# EAGLE design uC board (EAGLE 9.6.2)
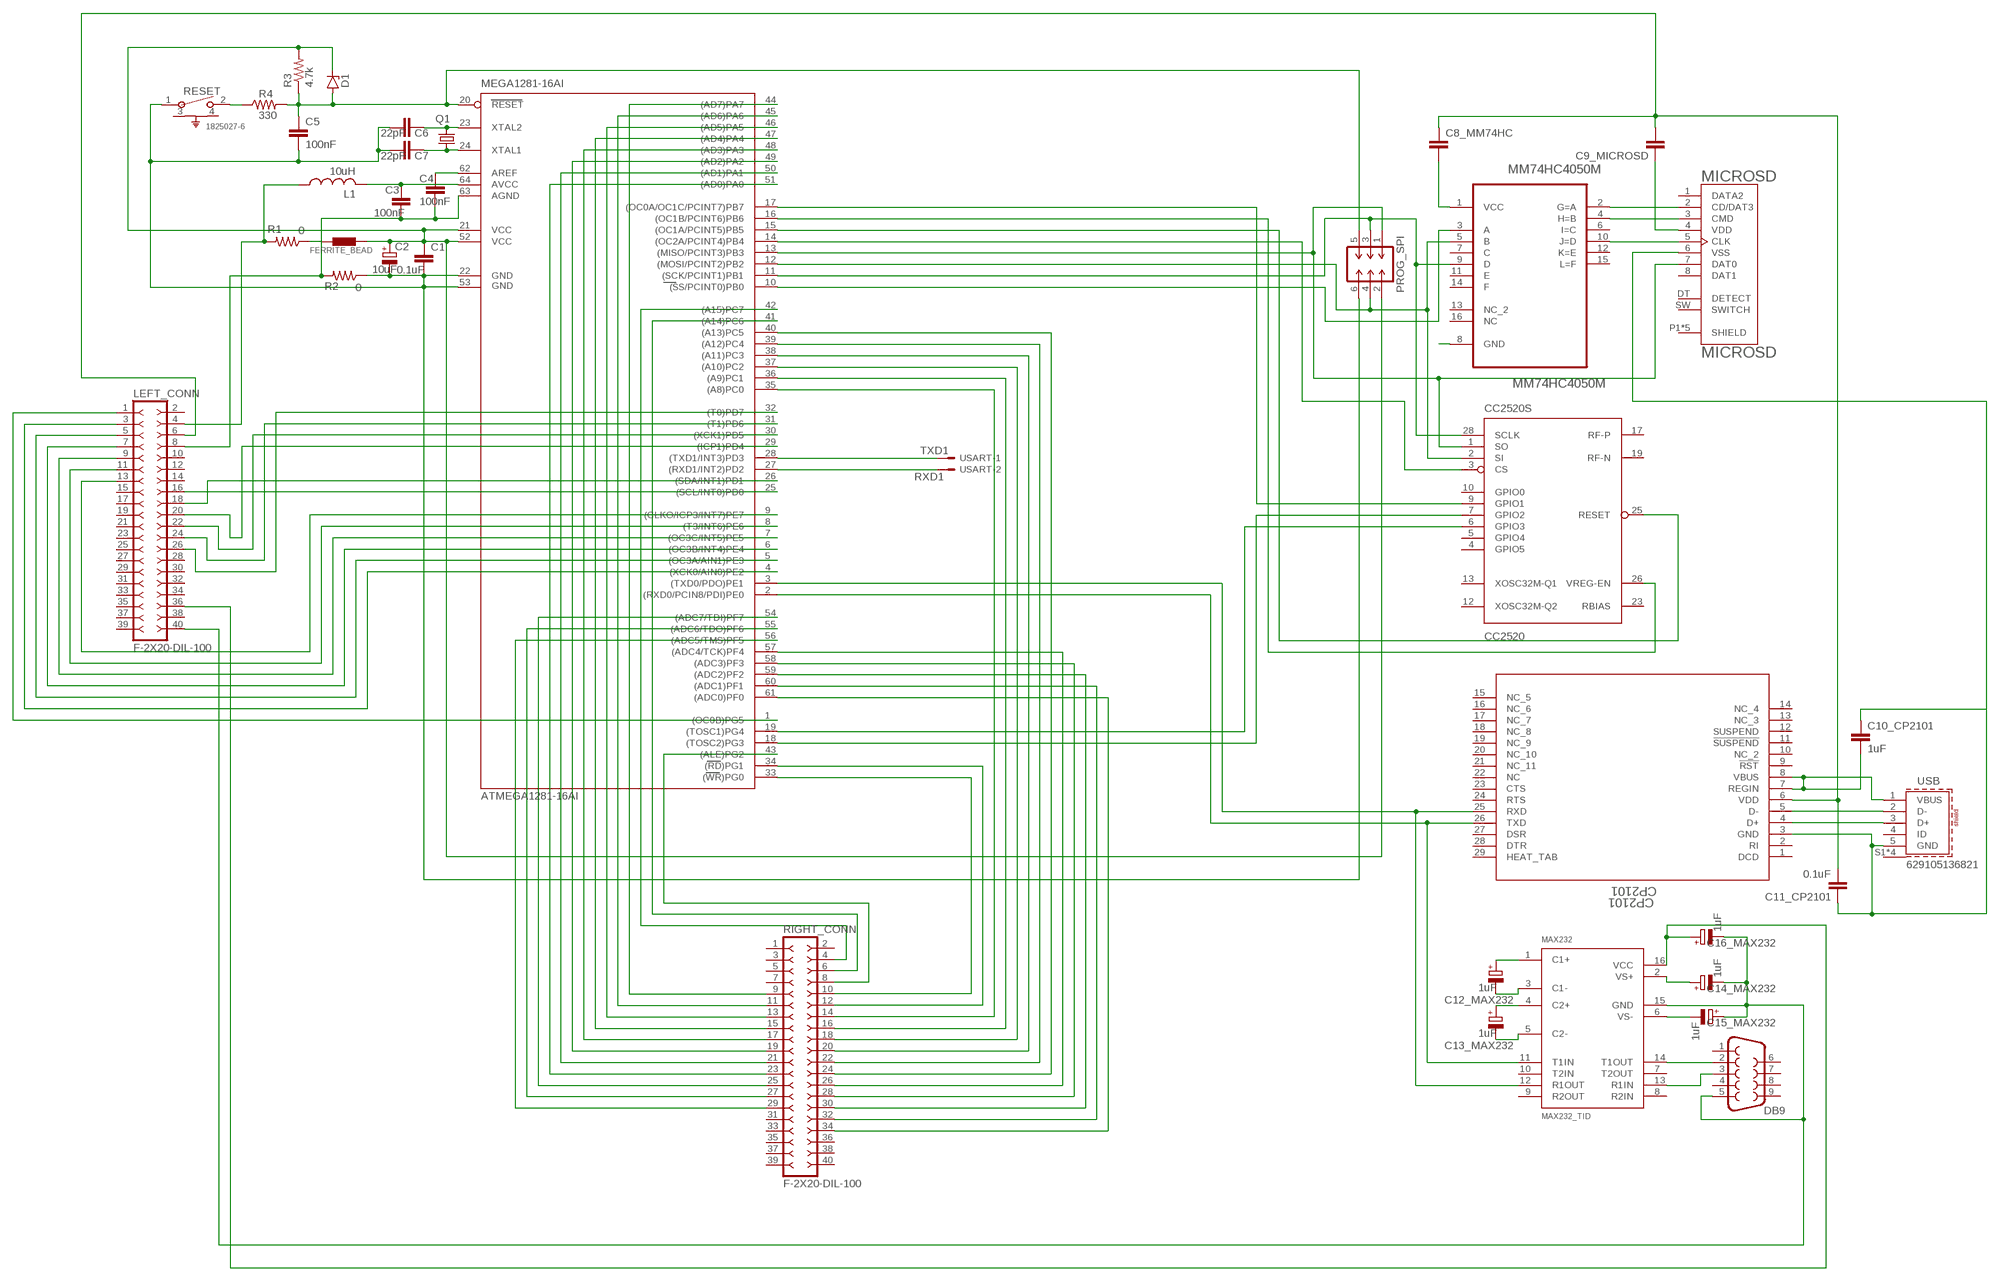
[diagram p0: schematic, sheet 1]

## Parts
C1  0.1uF  C-EUC0805K  [C0805K]
C2  10uF  CPOL-EUE5-10.5  [E5-10,5]
C3  100nF  C-EU025-024X044  [C025-024X044]
C4  100nF  C-EU025-024X044  [C025-024X044]
C5  100nF  C-EU025-024X044  [C025-024X044]
C6  22pF  C-EU025-024X044  [C025-024X044]
C7  22pF  C-EU025-024X044  [C025-024X044]
C8_MM74HC  C-EUC1210  [C1210]
C9_MICROSD  C-EUC1210  [C1210]
C10_CP2101  1uF  C-EUC1210  [C1210]
C11_CP2101  0.1uF  C-EUC1210  [C1210]
C12_MAX232  1uF  CPOL-EUE5-10.5  [E5-10,5]
C13_MAX232  1uF  CPOL-EUE5-10.5  [E5-10,5]
C14_MAX232  1uF  CPOL-EUE5-10.5  [E5-10,5]
C15_MAX232  1uF  CPOL-EUE5-10.5  [E5-10,5]
C16_MAX232  1uF  CPOL-EUE5-10.5  [E5-10,5]
CC2520  CC2520  [QFN50P500X500X100-29N]
CP2101  CP2101  [MLP28_SIL]
D1  ZENER-DIODEDO34-7  [DO34Z7]
DB9  DB9MALE  [DB9_MALE]
FERRITE_BEAD  BLM15HB121SN1  [0402]
L1  10uH  L-US0204/7  [0204/7]
LEFT_CONN  F-2X20-DIL-100  [DIL-100-2X20]
MAX232  MAX232_TID  [R-PDSO-G16]
MEGA1281-16AI  ATMEGA1281-16AI  [TQFP64]
MICROSD  MICROSD  [MOLEX_503182-1852]
MM74HC4050M  MM74HC4050M  [SOIC127P600X175-16N]
PROG_SPI  M-2X03-DIL-2MM_M  [DIL-2MM-2X03_M]
Q1  CRYSTALHC49S  [HC49/S]
R1  0  R-US_0204/5  [0204/5]
R2  0  R-US_0204/5  [0204/5]
R3  4.7k  R-US_0204/5  [0204/5]
R4  330  R-US_0204/5  [0204/5]
RESET  1825027-6  [SW2_1825027-B]
RIGHT_CONN  F-2X20-DIL-100  [DIL-100-2X20]
USART  332-02  [332-02]
USB  629105136821  [629105136821]

## Nets
N$1: C1.1 C2.+ D1.C FERRITE_BEAD.1 MEGA1281-16AI.21(VCC) MEGA1281-16AI.52(VCC1) PROG_SPI.2 R3.2
N$2: CC2520.1(S:SO) MEGA1281-16AI.13((MISO/PCINT3)PB3) MICROSD.7(DAT0) PROG_SPI.1
N$3: C3.1 L1.2 MEGA1281-16AI.64(AVCC)
N$4: C4.1 MEGA1281-16AI.62(AREF)
N$5: C3.2 C4.2 LEFT_CONN.8 MEGA1281-16AI.63(AGND) R2.2
N$6: FERRITE_BEAD.2 R1.1
N$7: L1.1 LEFT_CONN.4 R1.2
N$8: C5.1 D1.A MEGA1281-16AI.20(RESET) PROG_SPI.5 R3.1 R4.2
N$9: R4.1 RESET.2
N$10: C6.2 MEGA1281-16AI.23(XTAL2) Q1.2
N$11: C7.2 MEGA1281-16AI.24(XTAL1) Q1.1
N$12: CP2101.26(TXD) MAX232.11(T1IN) MEGA1281-16AI.2((RXD0/PCIN8/PDI)PE0)
N$13: CC2520.28(S:SCLK) MEGA1281-16AI.11((SCK/PCINT1)PB1) MM74HC4050M.9(D) PROG_SPI.3
N$14: CC2520.2(S:SI) MEGA1281-16AI.12((MOSI/PCINT2)PB2) MM74HC4050M.5(B) PROG_SPI.4
N$15: MICROSD.5(CLK) MM74HC4050M.10(J=D)
N$16: MEGA1281-16AI.10((SS/PCINT0)PB0) MM74HC4050M.3(A)
N$17: MICROSD.3(CMD) MM74HC4050M.4(H=B)
N$18: MICROSD.2(CD/DAT3) MM74HC4050M.2(G=A)
N$19: C9_MICROSD.1 MICROSD.4(VDD)
N$20: C10_CP2101.1 C11_CP2101.1 CP2101.3(GND) MICROSD.6(VSS) USB.5(GND)
N$21: C1.2 C2.- C5.2 C6.1 C7.1 MEGA1281-16AI.22(GND) MEGA1281-16AI.53(GND1) PROG_SPI.6 R2.1 RESET.1
N$22: C8_MM74HC.2 MM74HC4050M.1(VCC)
N$23: CC2520.3(S:CS) MEGA1281-16AI.14((OC2A/PCINT4)PB4)
N$24: CC2520.25(S:RESET) MEGA1281-16AI.15((OC1A/PCINT5)PB5)
N$25: CC2520.26(S:VREG-EN) MEGA1281-16AI.16((OC1B/PCINT6)PB6)
N$26: CC2520.9(S:GPIO1) MEGA1281-16AI.17((OC0A/OC1C/PCINT7)PB7)
N$27: CC2520.7(S:GPIO2) MEGA1281-16AI.18((TOSC2)PG3)
N$28: CC2520.6(S:GPIO3) MEGA1281-16AI.19((TOSC1)PG4)
N$29: MM74HC4050M.8(GND)
N$30: MEGA1281-16AI.28((TXD1/INT3)PD3) USART.1
N$31: C14_MAX232.- C15_MAX232.+ C16_MAX232.- DB9.5 LEFT_CONN.40 MAX232.15(GND)
N$32: C10_CP2101.2 CP2101.7(REGIN) CP2101.8(VBUS) USB.1(VBUS)
N$33: CP2101.5(D-) USB.2(D-)
N$34: CP2101.4(D+) USB.3(D+)
N$35: MEGA1281-16AI.27((RXD1/INT2)PD2) USART.2
N$37: C8_MM74HC.1 C9_MICROSD.2 C11_CP2101.2 CP2101.6(VDD) LEFT_CONN.6
N$39: CP2101.25(RXD) MAX232.12(R1OUT) MEGA1281-16AI.3((TXD0/PDO)PE1)
N$40: C13_MAX232.+ MAX232.4(C2+)
N$41: C12_MAX232.+ MAX232.1(C1+)
N$42: C12_MAX232.- MAX232.3(C1-)
N$43: C13_MAX232.- MAX232.5(C2-)
N$44: C14_MAX232.+ MAX232.2(VS+)
N$45: C15_MAX232.- MAX232.6(VS-)
N$47: C16_MAX232.+ LEFT_CONN.36 MAX232.16(VCC)
N$48: DB9.2 MAX232.14(T1OUT)
N$49: DB9.3 MAX232.13(R1IN)
N$50: LEFT_CONN.1 MEGA1281-16AI.1((OC0B)PG5)
N$51: LEFT_CONN.3 MEGA1281-16AI.4((XCK0/AIN0)PE2)
N$52: LEFT_CONN.5 MEGA1281-16AI.5((OC3A/AIN1)PE3)
N$53: LEFT_CONN.7 MEGA1281-16AI.6((OC3B/INT4)PE4)
N$54: LEFT_CONN.9 MEGA1281-16AI.7((OC3C/INT5)PE5)
N$55: LEFT_CONN.11 MEGA1281-16AI.8((T3/INT6)PE6)
N$56: LEFT_CONN.13 MEGA1281-16AI.9((CLKO/ICP3/INT7)PE7)
N$57: LEFT_CONN.16 MEGA1281-16AI.25((SCL/INT0)PD0)
N$58: LEFT_CONN.18 MEGA1281-16AI.26((SDA/INT1)PD1)
N$61: LEFT_CONN.20 MEGA1281-16AI.29((ICP1)PD4)
N$62: LEFT_CONN.22 MEGA1281-16AI.30((XCK1)PD5)
N$63: LEFT_CONN.24 MEGA1281-16AI.31((T1)PD6)
N$64: LEFT_CONN.26 MEGA1281-16AI.32((T0)PD7)
N$65: MEGA1281-16AI.41((A14)PC6) RIGHT_CONN.6
N$66: MEGA1281-16AI.42((A15)PC7) RIGHT_CONN.4
N$67: MEGA1281-16AI.43((ALE)PG2) RIGHT_CONN.8
N$68: MEGA1281-16AI.44((AD7)PA7) RIGHT_CONN.9
N$69: MEGA1281-16AI.45((AD6)PA6) RIGHT_CONN.11
N$70: MEGA1281-16AI.46((AD5)PA5) RIGHT_CONN.13
N$71: MEGA1281-16AI.47((AD4)PA4) RIGHT_CONN.15
N$72: MEGA1281-16AI.48((AD3)PA3) RIGHT_CONN.17
N$73: MEGA1281-16AI.49((AD2)PA2) RIGHT_CONN.19
N$74: MEGA1281-16AI.50((AD1)PA1) RIGHT_CONN.21
N$75: MEGA1281-16AI.51((AD0)PA0) RIGHT_CONN.23
N$76: MEGA1281-16AI.54((ADC7/TDI)PF7) RIGHT_CONN.25
N$77: MEGA1281-16AI.55((ADC6/TDO)PF6) RIGHT_CONN.27
N$78: MEGA1281-16AI.56((ADC5/TMS)PF5) RIGHT_CONN.29
N$79: MEGA1281-16AI.33((WR)PG0) RIGHT_CONN.10
N$80: MEGA1281-16AI.34((RD)PG1) RIGHT_CONN.12
N$81: MEGA1281-16AI.35((A8)PC0) RIGHT_CONN.14
N$82: MEGA1281-16AI.36((A9)PC1) RIGHT_CONN.16
N$83: MEGA1281-16AI.37((A10)PC2) RIGHT_CONN.18
N$84: MEGA1281-16AI.38((A11)PC3) RIGHT_CONN.20
N$85: MEGA1281-16AI.39((A12)PC4) RIGHT_CONN.22
N$86: MEGA1281-16AI.40((A13)PC5) RIGHT_CONN.24
N$87: MEGA1281-16AI.57((ADC4/TCK)PF4) RIGHT_CONN.26
N$88: MEGA1281-16AI.58((ADC3)PF3) RIGHT_CONN.28
N$89: MEGA1281-16AI.59((ADC2)PF2) RIGHT_CONN.30
N$90: MEGA1281-16AI.60((ADC1)PF1) RIGHT_CONN.32
N$91: MEGA1281-16AI.61((ADC0)PF0) RIGHT_CONN.34
Unconnected: CC2520.4(S:GPIO5) CC2520.5(S:GPIO4) CC2520.10(S:GPIO0) CC2520.12(S:XOSC32M-Q2) CC2520.13(S:XOSC32M-Q1) CC2520.15(NC) CC2520.17(S:RF-P) CC2520.18(NC) CC2520.19(S:RF-N) CC2520.21(NC) CC2520.23(S:RBIAS) CP2101.1(DCD) CP2101.2(RI) CP2101.9(!RST) CP2101.10(NC_2) CP2101.11(!SUSPEND) CP2101.12(SUSPEND) CP2101.13(NC_3) CP2101.14(NC_4) CP2101.15(NC_5) CP2101.16(NC_6) CP2101.17(NC_7) CP2101.18(NC_8) CP2101.19(NC_9) CP2101.20(NC_10) CP2101.21(NC_11) CP2101.22(NC) CP2101.23(CTS) CP2101.24(RTS) CP2101.27(DSR) CP2101.28(DTR) CP2101.29(HEAT_TAB) DB9.1 DB9.4 DB9.6 DB9.7 DB9.8 DB9.9 LEFT_CONN.2 LEFT_CONN.10 LEFT_CONN.12 LEFT_CONN.14 LEFT_CONN.15 LEFT_CONN.17 LEFT_CONN.19 LEFT_CONN.21 LEFT_CONN.23 LEFT_CONN.25 LEFT_CONN.27 LEFT_CONN.28 LEFT_CONN.29 LEFT_CONN.30 LEFT_CONN.31 LEFT_CONN.32 LEFT_CONN.33 LEFT_CONN.34 LEFT_CONN.35 LEFT_CONN.37 LEFT_CONN.38 LEFT_CONN.39 MAX232.7(T2OUT) MAX232.8(R2IN) MAX232.9(R2OUT) MAX232.10(T2IN) MICROSD.1(DATA2) MICROSD.8(DAT1) MICROSD.DT(DETECT) MICROSD.P1(SHIELD) MICROSD.P2(SHIELD) MICROSD.P3(SHIELD) MICROSD.P4(SHIELD) MICROSD.P5(SHIELD) MICROSD.SW(SWITCH) MM74HC4050M.6(I=C) MM74HC4050M.7(C) MM74HC4050M.11(E) MM74HC4050M.12(K=E) MM74HC4050M.13(NC_2) MM74HC4050M.14(F) MM74HC4050M.15(L=F) MM74HC4050M.16(NC) RESET.3 RESET.4 RIGHT_CONN.1 RIGHT_CONN.2 RIGHT_CONN.3 RIGHT_CONN.5 RIGHT_CONN.7 RIGHT_CONN.31 RIGHT_CONN.33 RIGHT_CONN.35 RIGHT_CONN.36 RIGHT_CONN.37 RIGHT_CONN.38 RIGHT_CONN.39 RIGHT_CONN.40 USB.4(ID) USB.S1(SHIELD) USB.S2(SHIELD) USB.S3(SHIELD) USB.S4(SHIELD)

## Notes on the sheet
- TXD1
- RXD1

## Power pins joined to a net without a drawn wire
AGND: CC2520.29(P:AGND)
AVDD: CC2520.11(P:AVDD) CC2520.14(P:AVDD) CC2520.16(P:AVDD) CC2520.20(P:AVDD) CC2520.22(P:AVDD)
AVDD-GUARD: CC2520.24(P:AVDD-GUARD)
DCOUPL: CC2520.27(P:DCOUPL)
DVDD: CC2520.8(P:DVDD)

## Library data of the parts
C1 C3-C7 C8_MM74HC C9_MICROSD C10_CP2101 C11_CP2101 = rcl:C-EU: CAPACITOR, European symbol; SPICEPREFIX: C
C2 C12_MAX232 C13_MAX232 C14_MAX232 C15_MAX232 C16_MAX232 = rcl:CPOL-EU: POLARIZED CAPACITOR, European symbol; SPICEPREFIX: C
CC2520 = ti CCxxxx series-v2:CC2520: 2.4 GHZ IEEE 802.15.4/ZIGBEE® RF TRANSCEIVER
CP2101 = CP2101:CP2101; BUILT_BY: EMA_UL_Team; MANUFACTURER_PART_NUMBER: CP2101; SOURCELIBRARY: Silicon_2010-04-20; VENDOR: Silicon Labs
D1 = diode:ZENER-DIODE: Z-Diode
DB9 = SparkFun-Connectors:DB9: DB9 Connector Standard DB9 (D-Sub 9) serial connector. Can be used for CAN bus as well as RS485 and RS232. Footprint production proven. Here is the female version connector we sell at SparkFun: 9 Pin Female Serial Connector - PCB Mount <https://www.sparkfun.com/products/429> (PRT-00429) This connector has been used on the following SparkFun products: SparkFun RS232 Shifter - SMD <https://www.sparkfun.com/products/449> (PRT-00449) SparkFun RS232 Shifter SMD (No DB9) <https://www.sparkfun.com/products/8780> (PRT-08780); PROD_ID: CONN-09904
FERRITE_BEAD = inductors:BLM15H: EMIFIL (R) Chip Ferrite Bead for GHz Noise Source: http://www.murata.com/ Ferrite Bead BLM15H.pdf
L1 = rcl:L-US: INDUCTOR, American symbol; SPICEPREFIX: L
LEFT_CONN RIGHT_CONN = con-headers-jp:F-2X20-: FEMALE HEADER
MAX232 = max232 ti_n:MAX232_TI: MAX232, Texas Instruments Version
MEGA1281-16AI = atmel-2005:ATMEGA1281*: MICROCONTROLLER 128 Kbytes FLASH 4 Kbytes EEPROM 8 Kbytes SRAM 54 General Purpose I/O pins 6-channels 16-bit PWM 2 x Serial USARTs 8-channels 10-bit A/D
MICROSD = SD card slots:MICROSD: Conn Micro SD Card M 8 POS 1.09mm Solder RA SMD Embossed T/R 0.5A/Contact Check prices <https://pricing.snapeda.com/search/part/5031821852/?ref=eda>; AVAILABILITY: Good; DESCRIPTION: 10 (8 + 2) Position Card Connector microSD™ Surface Mount, Right Angle Gold; MF: Molex; MP: 5031821852; PACKAGE: None; PRICE: None; PURCHASE-URL: https://pricing.snapeda.com/search/part/5031821852/?ref=eda
MM74HC4050M = MM74HC4050M:MM74HC4050M: Hex Inverting Logic Level Down Converter Check prices <https://pricing.snapeda.com/search/part/MM74HC4050M/?ref=eda> mm74hc4050m, logic level shifter; AVAILABILITY: Warning; DESCRIPTION: Buffer, Non-Inverting 6 Element 1 Bit per Element Push-Pull Output 16-TSSOP; MF: ON Semiconductor; MP: MM74HC4050M; PACKAGE: SOIC-16 Fairchild Semiconductor; PRICE: None; PURCHASE-URL: https://pricing.snapeda.com/search/part/MM74HC4050M/?ref=eda
PROG_SPI = con-headers-jp:M-2X03-: MALE HEADER
Q1 = crystal:CRYSTAL: CRYSTAL; OC_FARNELL: 1667008; OC_NEWARK: unknown
R1-R4 = rcl:R-US_: RESISTOR, American symbol; SPICEPREFIX: R
RESET = Switches:1825027-6; BUILT_BY: EMA_UL_Team; CATEGORY: Tactile Switches; CONFIGURATION__POLE-THROW_: Single Pole - Single Throw; COPYRIGHT: Copyright (C) 2016 Accelerated Designs. All rights reserved; DESCRIPTION: FSMRA2JHA04=R/A,TACT PB SW,260; MANUFACTURER_PART_NUMBER: 1825027-6; MAX_SWITCHING_CURRENT: -; MAX_SWITCHING_VOLTAGE_AC_: -; PART_STATUS: active; PRODUCT_TYPE: Switch; SERIES: Unknown; SWITCH_TYPE: Tactile Switches; TE_PART_NUMBER: 1825027-6; VENDOR: TE Connectivity
USART = con-garry:332-02: 2 Pin - 2mm Dual Row Source: www.mpe-connector.de / garry_shortform_2012.pdf
USB = Wurth_Connectors_WR-USB:629105136821: WR-COM Micro USB 2.0 SMT Type B Horizontal 5 Contacts Kind Properties Durability:10 000 Mating cycles Quality Class:10 000 Mating cycles Connector Type:Micro USB Gender:Receptacle Type:Horizontal General Information Operating Temperature:-40up to +105 °C Compliance:RoHS Electrical Properties IR 1:1A Working Voltage:30V (AC) Withstanding Voltage:100V (AC) Contact Resistance:30 mΩ Material Properties Insulator Material:LCP Insulator Flammability Rating:UL94 V-0 Color:Black Contact Material:Copper Alloy Contact Plating: Gold Contact Type:Stamped Shielding Material:Stainless Steel Shielding Plating:Nickel <https://www.we-online.com/catalog/media/o32999v209%20Family_WR-COM_629105136821.jpg> Details see: https://www.we-online.com/catalog/en/COM_MICRO_SMT_TYPE_B_HORIZONTAL/ Updated by Yingchun, Shan 2020-01-16 2020 (C) Würth Elektronik; APPLICATION: Micro USB 2.0; DATASHEET-URL: https://www.we-online.com/catalog/datasheet/629105136821.pdf; GERDER: Receptacle; INTERFACE-TYPE: Type B; IR1: 1.0A; MOUNT: SMT; PACKAGING: Tape and Reel; PART-NUMBER: 629105136821; PINS: 5; TYPE: Horizontal; WORKING-VOLTAGE: 30V(AC)

## Board
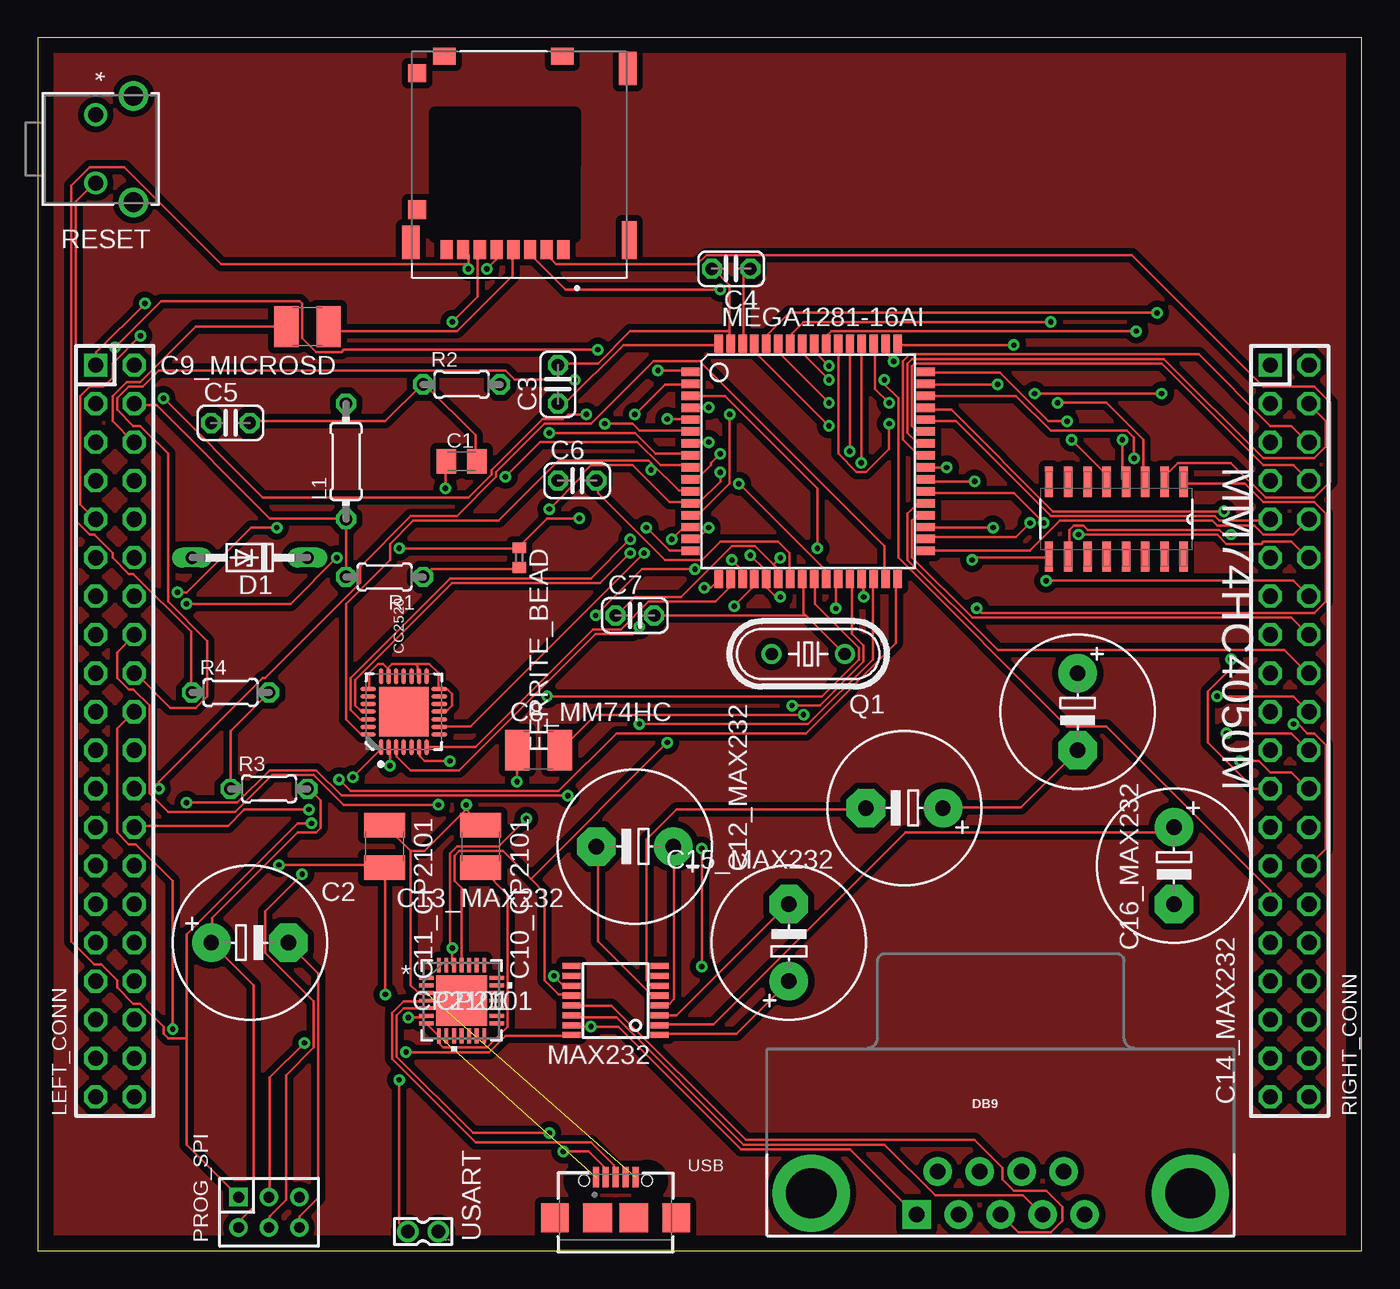
[diagram p1: board, top side]
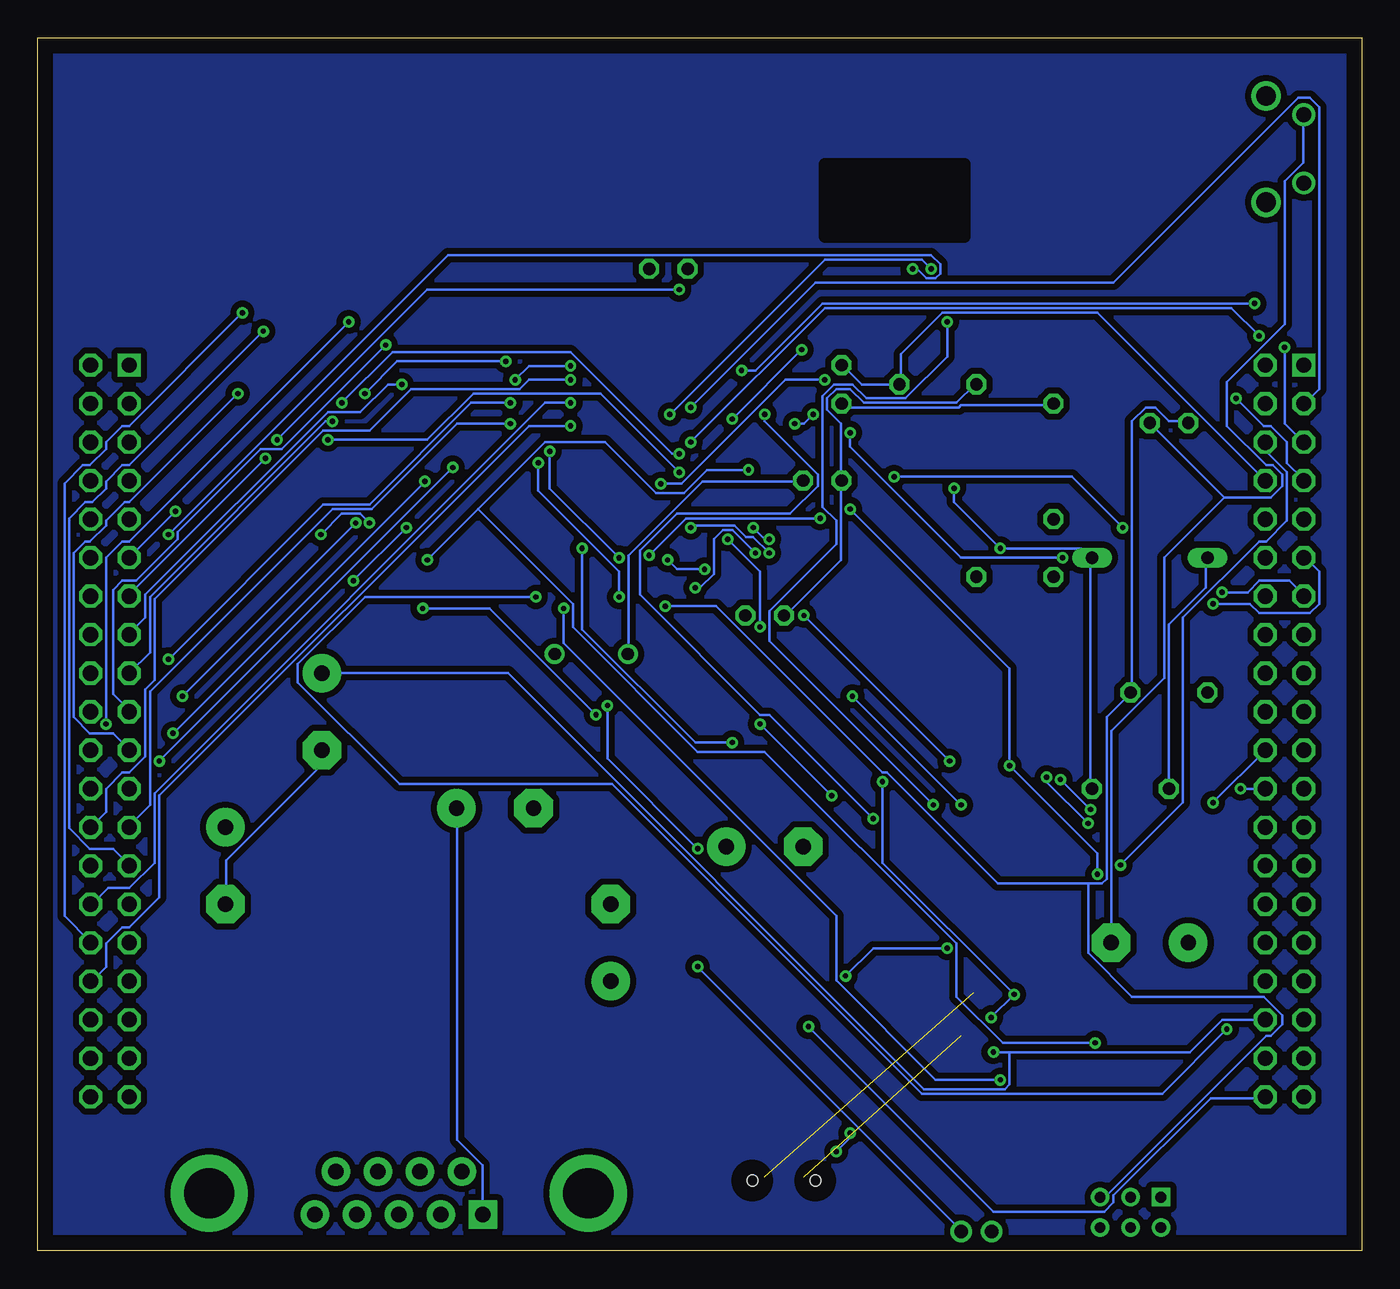
[diagram p2: board, bottom side, seen from below]

Size 87.3 x 80 mm. Coordinates in mm from the lower left corner, seen from the top.
Outline: 0,0 87.3,0 87.3,80 0,80 0,0
Copper layers (1*16): Top 0.035mm / dielectric 1.5mm / Bottom 0.035mm
Design rules "default": minimum track width 6mil, minimum drill 0.35mm, track to track 6mil, track to pad 6mil, pad to pad 6mil, via to via 6mil, smd to smd 6mil, copper to edge 40mil, drill to drill 6mil, minimum pad ring 10mil, minimum via ring 8mil, stop-mask expansion 4mil, vias tented up to drill 0mil, thermal gap 10mil

### Footprints (pad centres in the part's own frame; a part is rotated, then mirrored left to right if it is on the bottom)
C0805K = smd 1.3 x 1.6: 1 -1,0; 2 1,0
E5-10,5 = drill 1.016 pad 2.54: + -2.54,0 | drill 1.016 pad 2.54 octagon: - 2.54,0
C025-024X044 = drill 0.813 octagon: 1 -1.27,0; 2 1.27,0
C1210 = smd 1.6 x 2.7: 1 -1.4,0; 2 1.4,0
QFN50P500X500X100-29N = smd 1.05 x 0.3: 1 -2.35,1.5; 2 -2.35,1; 3 -2.35,0.5; 4 -2.35,0; 5 -2.35,-0.5; 6 -2.35,-1; 7 -2.35,-1.5; 15 2.35,-1.5; 16 2.35,-1; 17 2.35,-0.5; 18 2.35,0; 19 2.35,0.5; 20 2.35,1; 21 2.35,1.5 | smd 0.3 x 1.05: 8 -1.5,-2.35; 9 -1,-2.35; 10 -0.5,-2.35; 11 0,-2.35; 12 0.5,-2.35; 13 1,-2.35; 14 1.5,-2.35; 22 1.5,2.35; 23 1,2.35; 24 0.5,2.35; 25 0,2.35; 26 -0.5,2.35; 27 -1,2.35; 28 -1.5,2.35 | smd 3.25 x 3.25: 29 0,0
MLP28_SIL = smd 0.965 x 0.254: 1 -2.324,1.5; 2 -2.324,1; 3 -2.324,0.5; 4 -2.324,0; 5 -2.324,-0.5; 6 -2.324,-1; 7 -2.324,-1.5; 15 2.324,-1.5; 16 2.324,-1; 17 2.324,-0.5; 18 2.324,0; 19 2.324,0.5; 20 2.324,1; 21 2.324,1.5 | smd 0.254 x 0.965: 8 -1.5,-2.324; 9 -1,-2.324; 10 -0.5,-2.324; 11 0,-2.324; 12 0.5,-2.324; 13 1,-2.324; 14 1.5,-2.324; 22 1.5,2.324; 23 1,2.324; 24 0.5,2.324; 25 0,2.324; 26 -0.5,2.324; 27 -1,2.324; 28 -1.5,2.324 | smd 3.353 x 3.353: 29 0,0
DO34Z7 = drill 0.813 long: A 3.81,0; C -3.81,0
DB9_MALE = drill 1.016 pad 1.88: 1 5.54,-1.42; 2 2.77,-1.42; 3 0,-1.42; 4 -2.77,-1.42; 6 4.15,1.42; 7 1.38,1.42; 8 -1.38,1.42; 9 -4.15,1.42 | drill 1.016 pad 1.88 square: 5 -5.54,-1.42 | drill 3.302 pad 5.08: G1 -12.5,0; G2 12.5,0
0402 = smd 0.7 x 0.9: 1 -0.65,0; 2 0.65,0
0204/7 = drill 0.813 octagon: 1 -3.81,0; 2 3.81,0
DIL-100-2X20 = drill 1.016 square: 1 -24.13,-1.27 | drill 1.016 octagon: 2 -24.13,1.27; 3 -21.59,-1.27; 4 -21.59,1.27; 5 -19.05,-1.27; 6 -19.05,1.27; 7 -16.51,-1.27; 8 -16.51,1.27; 9 -13.97,-1.27; 10 -13.97,1.27; 11 -11.43,-1.27; 12 -11.43,1.27; 13 -8.89,-1.27; 14 -8.89,1.27; 15 -6.35,-1.27; 16 -6.35,1.27; 17 -3.81,-1.27; 18 -3.81,1.27; 19 -1.27,-1.27; 20 -1.27,1.27; 21 1.27,-1.27; 22 1.27,1.27; 23 3.81,-1.27; 24 3.81,1.27; 25 6.35,-1.27; 26 6.35,1.27; 27 8.89,-1.27; 28 8.89,1.27; 29 11.43,-1.27; 30 11.43,1.27; 31 13.97,-1.27; 32 13.97,1.27; 33 16.51,-1.27; 34 16.51,1.27; 35 19.05,-1.27; 36 19.05,1.27; 37 21.59,-1.27; 38 21.59,1.27; 39 24.13,-1.27; 40 24.13,1.27
R-PDSO-G16 = smd 0.4 x 1.2: 1 -2.275,-2.9; 2 -1.625,-2.9; 3 -0.975,-2.9; 4 -0.325,-2.9; 5 0.325,-2.9; 6 0.975,-2.9; 7 1.625,-2.9; 8 2.275,-2.9; 9 2.275,2.9; 10 1.625,2.9; 11 0.975,2.9; 12 0.325,2.9; 13 -0.325,2.9; 14 -0.975,2.9; 15 -1.625,2.9; 16 -2.275,2.9
TQFP64 = smd 1.194 x 0.559: 1 -7.76,5.905; 2 -7.76,5.118; 3 -7.76,4.331; 4 -7.76,3.543; 5 -7.76,2.756; 6 -7.76,1.968; 7 -7.76,1.181; 8 -7.76,0.394; 9 -7.76,-0.394; 10 -7.76,-1.181; 11 -7.76,-1.968; 12 -7.76,-2.756; 13 -7.76,-3.543; 14 -7.76,-4.331; 15 -7.76,-5.118; 16 -7.76,-5.905; 33 7.76,-5.905; 34 7.76,-5.118; 35 7.76,-4.331; 36 7.76,-3.543; 37 7.76,-2.756; 38 7.76,-1.968; 39 7.76,-1.181; 40 7.76,-0.394; 41 7.76,0.394; 42 7.76,1.181; 43 7.76,1.968; 44 7.76,2.756; 45 7.76,3.543; 46 7.76,4.331; 47 7.76,5.118; 48 7.76,5.905 | smd 0.559 x 1.194: 17 -5.905,-7.76; 18 -5.118,-7.76; 19 -4.331,-7.76; 20 -3.543,-7.76; 21 -2.756,-7.76; 22 -1.968,-7.76; 23 -1.181,-7.76; 24 -0.394,-7.76; 25 0.394,-7.76; 26 1.181,-7.76; 27 1.968,-7.76; 28 2.756,-7.76; 29 3.543,-7.76; 30 4.331,-7.76; 31 5.118,-7.76; 32 5.905,-7.76; 49 5.905,7.76; 50 5.118,7.76; 51 4.331,7.76; 52 3.543,7.76; 53 2.756,7.76; 54 1.968,7.76; 55 1.181,7.76; 56 0.394,7.76; 57 -0.394,7.76; 58 -1.181,7.76; 59 -1.968,7.76; 60 -2.756,7.76; 61 -3.543,7.76; 62 -4.331,7.76; 63 -5.118,7.76; 64 -5.905,7.76
MOLEX_503182-1852 = smd 0.8 x 1.24: 1 -2.9,6.355; 2 -1.8,6.355; 3 -0.7,6.355; 4 0.4,6.355; 5 1.5,6.355; 6 2.6,6.355; 7 3.7,6.355; 8 4.8,6.355 | smd 1.16 x 1.2: DT 6.74,-5.275 | smd 0.95 x 2.5: P1 -7.245,5.725 | smd 1.15 x 2.2: P2 7.145,5.875; P3 -7.145,-5.605 | smd 1.5 x 1.15: P4 -2.84,-6.4; P5 4.94,-6.4 | smd 1.16 x 1.25: SW 6.74,3.725
SOIC127P600X175-16N = smd 1.981 x 0.559: 1 -2.464,4.445; 2 -2.464,3.175; 3 -2.464,1.905; 4 -2.464,0.635; 5 -2.464,-0.635; 6 -2.464,-1.905; 7 -2.464,-3.175; 8 -2.464,-4.445; 9 2.464,-4.445; 10 2.464,-3.175; 11 2.464,-1.905; 12 2.464,-0.635; 13 2.464,0.635; 14 2.464,1.905; 15 2.464,3.175; 16 2.464,4.445
DIL-2MM-2X03_M = drill 0.711 square: 1 -2,1 | drill 0.711: 2 -2,-1; 3 0,1; 4 0,-1; 5 2,1; 6 2,-1
HC49/S = drill 0.813: 1 -2.413,0; 2 2.413,0
0204/5 = drill 0.813 octagon: 1 -2.54,0; 2 2.54,0
SW2_1825027-B = drill 0.991 pad 1.499: 1 0,0; 2 4.496,0 | drill 1.295 pad 1.803: 3 -1.245,2.489; 4 5.766,2.489
332-02 = drill 0.9 pad 1.27: 1 0,-1; 2 0,1
629105136821 = smd 0.4 x 1.35: 1 -1.3,2.325; 2 -0.65,2.325; 3 0,2.325; 4 0.65,2.325; 5 1.3,2.325 | smd 1.8 x 1.9: S1 -4,-0.35; S4 4,-0.35 | smd 1.9 x 1.9: S2 -1.2,-0.35; S3 1.2,-0.35 | hole 0.7: -2.075,2.1; 2.075,2.1

### Placement (x,y rotation side)
C1  27.94,52.07 0 top
C2  13.97,20.32 0 top
C3  34.29,57.15 90 top
C4  45.72,64.77 180 top
C5  12.7,54.61 0 top
C6  35.56,50.8 0 top
C7  39.37,41.91 0 top
C8_MM74HC  33.02,33.02 0 top
C9_MICROSD  17.78,60.96 180 top
C10_CP2101  29.21,26.67 270 top
C11_CP2101  22.86,26.67 270 top
C12_MAX232  49.53,20.32 90 top
C13_MAX232  39.37,26.67 180 top
C14_MAX232  74.93,25.4 270 top
C15_MAX232  57.15,29.21 180 top
C16_MAX232  68.58,35.56 270 top
CC2520  24.13,35.56 90 top
CP2101  27.94,16.51 0 top
D1  13.97,45.72 180 top
DB9  63.5,3.81 0 top
FERRITE_BEAD  31.75,45.72 270 top
L1  20.32,52.07 90 top
LEFT_CONN  5.08,34.29 270 top
MAX232  38.1,16.51 90 top
MEGA1281-16AI  50.8,52.07 0 top
MICROSD  31.75,72.39 180 top
MM74HC4050M  71.12,48.26 270 top
PROG_SPI  15.24,2.54 0 top
Q1  50.8,39.37 180 top
R1  22.86,44.45 180 top
R2  27.94,57.15 0 top
R3  15.24,30.48 0 top
R4  12.7,36.83 0 top
RESET  3.81,74.93 270 top
RIGHT_CONN  82.55,34.29 270 top
USART  25.4,1.27 90 top
USB  38.1,2.54 0 top

### Tracks (layer width: path | path; a pad name or v marks a point on that pad's centre or on a via)
AVDD
  Top 0.152: CC2520.11 26.57,35.66 27.03,35.66 27.33,35.97 27.33,36.73 27.03,37.03 26.57,37.03 CC2520.14 26.42,37.19 26.42,38.1 25.81,38.71 24.89,38.71 | 23.06,38.41 22.76,38.71 22.45,38.71 21.84,38.1 21.84,37.19 CC2520.22 | 23.06,38.41 23.06,37.95 CC2520.20 23.06,38.41 | 24.89,38.71 25.04,38.56 25.04,37.95 CC2520.16 | 24.89,38.71 23.37,38.71 23.06,38.41
GND
  pour Top (isolate 0.406): 0,80.01 87.63,80.01 87.63,0 0,0
  pour Bottom (isolate 0.406): 0,80.01 87.63,80.01 87.63,0 0,0
N$1  (via drill 0.35)
  Top 0.152: PROG_SPI.2 13.31,1.68 13.31,1.98 14.22,2.9 14.22,17.53 C2.+ 11.48,20.42 11.48,21.95 17.12,27.58 18.34,27.58 18.64,27.89 18.64,29.72 17.88,30.48 R3.2 | v23.83,46.33 31.75,46.33 FERRITE_BEAD.1 31.75,46.48 33.58,48.31 v35.71,48.31 | v46.99,45.87 47.9,44.96 47.9,44.35 MEGA1281-16AI.21 48.06,44.2 48.06,43.74 48.67,43.13 v48.97,43.13 | v54.3,51.97 54.3,59.74 MEGA1281-16AI.52 | v26.87,50.29 26.87,51.97 C1.1
  Bottom 0.152: 17.88,45.72 18.49,46.33 v23.83,46.33 26.87,49.38 v26.87,50.29 | v46.99,45.87 44.55,48.31 v35.71,48.31 | v54.3,51.97 54.3,50.14 48.97,44.81 v48.97,43.13 | 17.88,45.72 17.88,30.48 R3.2 | 17.88,45.72 D1.C
N$2  (via drill 0.35)
  Top 0.152: v45.62,55.17 45.62,50.6 43.64,48.62 43.18,48.62 MEGA1281-16AI.13 | 28.4,65.08 28.4,65.68 28.09,65.99 MICROSD.7 | v20.78,31.24 22.61,33.07 CC2520.1 | v18.03,28.19 17.12,28.19 9.8,20.88 9.8,14.02 | 9.8,14.02 9.8,7.01 13.16,3.66 PROG_SPI.1 | 28.4,65.08 12.09,65.08 5.69,71.48 3.4,71.48 2.18,70.26 2.18,20.42 3.71,18.9 4.17,18.9 5.23,17.83 5.23,17.37 6.3,16.31 6.76,16.31 8.28,14.78 8.28,14.33 8.59,14.02 9.8,14.02 | 28.4,65.08 v28.4,64.77
  Bottom 0.152: v45.62,55.17 35.41,65.38 29.01,65.38 v28.4,64.77 | v20.78,31.24 20.78,30.94 v18.03,28.19
N$3
  Top 0.152: MEGA1281-16AI.64 44.86,59.74 38.61,59.74 34.8,55.93 34.34,55.93 C3.1
  Bottom 0.152: C3.1 34.04,55.63 26.57,55.63 26.42,55.78 20.32,55.78 L1.2
N$4
  Top 0.152: C4.1 46.53,64.31 46.53,59.89 MEGA1281-16AI.62
N$5
  Top 0.152: 45.62,60.66 45.62,63.7 44.55,64.77 C4.2 | 45.62,60.66 45.62,59.89 MEGA1281-16AI.63 | 45.62,60.66 39.06,60.66 36.93,58.52 34.34,58.52 C3.2
  Bottom 0.152: C3.2 34.19,58.37 32.97,57.15 R2.2 30.38,57.15 30.38,59.13 27.63,61.87 17.42,61.87 LEFT_CONN.8
N$6
  Top 0.152: FERRITE_BEAD.2 31.75,44.96 25.96,44.96 25.5,44.5 R1.1
N$7
  Top 0.152: R1.2 L1.1 20.32,48.31 15.29,48.31 7.82,55.78 6.45,55.78 LEFT_CONN.4
N$8  (via drill 0.35)
  Top 0.152: v45.92,42.52 47.14,43.74 47.14,44.2 MEGA1281-16AI.20 | R3.1 12.7,34.29 R4.2
  Bottom 0.152: R3.1 12.7,41.3 10.26,43.74 10.26,45.72 D1.A | v45.92,42.52 42.57,42.52 31.6,31.55 31.29,31.55 23.98,24.23 18.03,24.23 | 18.03,24.23 17.12,24.23 16.81,24.54 16.81,35.2 15.29,36.73 R4.2 15.14,36.88 15.14,54.71 14.22,55.63 13.61,55.63 12.7,54.71 11.48,54.71 C5.1 | 18.03,24.23 18.03,19.66 15.14,16.76 6.45,16.76 5.23,15.54 5.23,14.94 5.99,14.17 6.3,14.17 16.81,3.66 17.12,3.66 PROG_SPI.5
N$9
  Top 0.152: R4.1 10.11,36.88 10.11,40.84 6.3,44.65 5.99,44.65 4.93,45.72 4.93,46.02 3.71,47.24 3.4,47.24 2.49,48.16 2.49,69.19 3.71,70.41 RESET.2
N$10
  Top 0.152: MEGA1281-16AI.23 49.58,44.35 49.58,46.02 48.82,46.79 45.01,46.79 43.79,45.57 41.35,45.57 36.93,49.99 36.93,50.75 C6.2
  Bottom 0.152: Q1.2 48.36,39.47 48.36,45.87 43.48,50.75 36.93,50.75 C6.2
N$11
  Top 0.152: 50.65,41.91 53.09,39.47 Q1.1 | 50.65,41.91 50.49,42.06 50.49,44.2 MEGA1281-16AI.24 | 50.65,41.91 C7.2
N$12  (via drill 0.35)
  Top 0.152: v34.04,18.14 34.65,17.53 35.1,17.53 MAX232.11 | CP2101.26 27.33,18.9 v27.33,19.96 27.18,20.12 27.18,26.21 27.63,26.67 30.38,26.67 v32.21,28.5 | v39.37,55.17 41.35,57.15 43.03,57.15 MEGA1281-16AI.2
  Bottom 0.152: v27.33,19.96 32.21,19.96 v34.04,18.14 | v39.37,55.17 39.37,54.71 35.87,51.21 35.87,50.44 37.69,48.62 45.16,48.62 47.6,46.18 47.6,43.28 39.67,35.36 39.06,35.36 v32.21,28.5
N$13  (via drill 0.35)
  Top 0.152: 40.44,51.97 42.27,50.14 43.03,50.14 MEGA1281-16AI.11 | 40.44,51.97 40.28,52.12 34.34,52.12 30.38,48.16 24.74,48.16 23.22,46.63 23.22,45.57 20.32,42.67 20.32,35.05 21.23,34.14 21.69,34.14 CC2520.28 | v61.62,45.57 61.77,45.72 66.65,45.72 MM74HC4050M.9 | 40.44,51.97 v40.44,51.51 | v17.58,13.72 15.29,11.43 15.29,3.66 PROG_SPI.3
  Bottom 0.152: 58.27,48.92 53.85,53.34 49.89,53.34 46.53,49.99 44.7,49.99 43.18,51.51 v40.44,51.51 | 58.27,48.92 v61.62,45.57 | v17.58,13.72 23.67,13.72 26.72,16.76 26.72,20.27 39.37,32.92 43.79,32.92 52.02,41.15 52.02,42.67 58.27,48.92
N$14  (via drill 0.35)
  Top 0.152: v23.22,32 23.22,33.07 CC2520.2 | v33.73,48.92 35.87,51.05 35.87,51.21 36.47,51.82 39.22,51.82 41.66,49.38 43.03,49.38 MEGA1281-16AI.12 43.18,49.38 43.64,49.38 45.01,50.75 v45.01,51.36 | v68.17,53.49 70.46,51.21 70.46,50.75 MM74HC4050M.5 | v17.42,24.84 14.99,22.4 14.99,19.66 18.19,16.46 18.19,13.41 16.36,11.58 16.36,3.35 15.29,2.29 15.29,1.68 PROG_SPI.4
  Bottom 0.152: v33.73,48.92 23.22,38.41 v23.22,32 17.42,26.21 v17.42,24.84 | v68.17,53.49 61.62,53.49 58.57,56.54 50.19,56.54 v45.01,51.36
N$15  (via drill 0.35)
  Top 0.152: v29.62,64.77 30.23,65.38 30.23,65.99 MICROSD.5 | v78.69,47.24 78.23,47.24 77.93,47.55 69.24,47.55 68.94,47.85 68.33,47.85 68.02,47.55 68.02,45.87 MM74HC4050M.10
  Bottom 0.152: v29.62,64.77 29.31,64.77 28.7,64.16 28.09,64.16 27.79,64.47 27.79,65.08 28.4,65.68 60.25,65.68 v78.69,47.24
N$16  (via drill 0.35)
  Top 0.152: v45.01,52.58 44.4,51.97 44.4,51.82 43.48,50.9 43.18,50.9 MEGA1281-16AI.10 | v67.26,55.93 70.46,55.93 72.9,53.49 72.9,50.75 MM74HC4050M.3
  Bottom 0.152: v45.01,52.58 45.47,52.58 52.17,59.28 63.91,59.28 v67.26,55.93
N$17  (via drill 0.35)
  Top 0.152: v45.01,63.4 34.8,63.4 32.51,65.68 32.51,65.99 MICROSD.3 | v71.53,53.49 71.53,50.9 71.68,50.75 MM74HC4050M.4
  Bottom 0.152: v45.01,63.4 61.62,63.4 v71.53,53.49
N$18
  Top 0.152: MICROSD.2 33.58,65.99 33.58,65.68 34.19,65.08 43.48,65.08 44.09,65.68 72.14,65.68 80.82,57 84.18,57 85.24,55.93 85.24,50.75 84.18,49.68 80.98,49.68 78.69,51.97 75.18,51.97 74.42,51.21 74.42,50.75 MM74HC4050M.2
N$19
  Top 0.152: MICROSD.4 31.29,65.99 31.29,64.31 27.63,60.66 19.56,60.66 19.25,60.96 C9_MICROSD.1
N$20  (via drill 0.35)  (1 unrouted)
  Top 0.152: 24.59,26.36 24.59,17.53 25.04,17.07 25.5,17.07 CP2101.3 | 24.59,26.36 22.91,28.04 C11_CP2101.1 | v27.33,61.27 29.01,62.94 29.01,65.99 MICROSD.6 | 28.24,29.11 29.16,28.19 C10_CP2101.1 | 24.59,26.36 25.5,26.36 28.24,29.11 | 28.24,29.11 v28.24,29.41
  Bottom 0.152: v27.33,61.27 27.33,58.98 30.07,56.24 32.66,56.24 33.58,57.15 34.8,57.15 35.56,56.39 35.56,49.07 34.65,48.16 34.65,46.63 39.06,42.22 39.06,40.23 v28.24,29.41
N$21  (via drill 0.35)
  Top 0.152: 48.51,45.26 47.3,46.48 45.77,46.48 42.42,43.13 39.37,43.13 38.15,41.91 C7.1 | 48.51,45.26 48.82,44.96 48.82,44.35 MEGA1281-16AI.22 | v53.54,52.73 53.54,59.74 MEGA1281-16AI.53 | 48.51,45.26 v48.97,45.72 | PROG_SPI.6 17.27,1.68 17.27,2.29 18.49,3.5 18.49,18.29 16.51,20.27 C2.- | C1.2 28.85,52.12 28.85,53.8 25.5,57.15 R2.1 25.35,57.15 22.91,54.71 14.07,54.71 C5.2
  Bottom 0.152: v53.54,52.73 53.54,50.29 v48.97,45.72 | C7.1 38,41.91 34.34,45.57 34.34,50.75 C6.1 34.34,50.9 34.34,54.56 35.25,55.47 35.25,56.24 34.65,56.84 33.73,56.84 32.82,55.93 26.72,55.93 25.5,57.15 R2.1 | 9.04,49.68 5.99,49.68 5.23,50.44 5.23,51.21 5.84,51.82 6.3,51.82 8.89,54.41 8.89,57.3 5.08,61.11 5.08,70.56 3.86,71.78 3.86,74.83 RESET.1 | C5.2 9.04,49.68 | C2.- 16.51,34.29 13.01,37.8 13.01,45.72 9.04,49.68
N$22  (via drill 0.35)
  Top 0.152: v61.93,42.37 62.23,42.06 84.18,42.06 84.94,42.82 84.94,48.62 84.18,49.38 80.82,49.38 79.6,50.6 75.64,50.6 MM74HC4050M.1 | v50.49,35.36 36.78,35.36 34.49,33.07 C8_MM74HC.2
  Bottom 0.152: v61.93,42.37 57.51,42.37 v50.49,35.36
N$23  (via drill 0.35)
  Top 0.152: v39.67,41.15 39.22,40.69 36.78,40.69 27.79,31.7 24.59,31.7 23.67,32.61 23.67,33.07 CC2520.3 | v41.81,46.94 42.57,47.7 43.03,47.7 MEGA1281-16AI.14
  Bottom 0.152: v39.67,41.15 39.67,44.81 v41.81,46.94
N$24  (via drill 0.35)
  Top 0.152: v39.06,46.02 37.08,44.04 27.33,44.04 20.93,37.64 20.93,35.97 21.23,35.66 21.69,35.66 CC2520.25 | v44.25,47.7 43.64,47.09 43.18,47.09 MEGA1281-16AI.15
  Bottom 0.152: v39.06,46.02 40.13,47.09 40.59,47.09 41.35,47.85 44.09,47.85 v44.25,47.7
N$25  (via drill 0.35)
  Top 0.152: v39.06,46.94 36.47,44.35 27.18,44.35 20.62,37.8 20.62,35.66 21.23,35.05 21.69,35.05 CC2520.26 | v40.13,47.7 41.66,46.18 43.03,46.18 MEGA1281-16AI.16
  Bottom 0.152: v39.06,46.94 39.37,46.94 v40.13,47.7
N$26  (via drill 0.35)
  Top 0.152: v39.98,46.02 28.55,34.59 26.57,34.59 CC2520.9 | v43.94,43.74 44.4,43.74 44.86,44.2 MEGA1281-16AI.17
  Bottom 0.152: v39.98,46.02 41.5,47.55 42.11,47.55 42.72,46.94 42.72,44.65 43.64,43.74 v43.94,43.74
N$27
  Top 0.152: CC2520.7 25.65,33.22 28.85,33.22 36.63,41 38.46,41 40.28,42.82 44.7,42.82 45.62,43.74 45.62,44.2 MEGA1281-16AI.18
N$28  (via drill 0.35)
  Top 0.152: v27.18,32.31 25.5,32.31 25.2,32.61 25.2,33.07 CC2520.6 | v36.78,41.91 39.83,44.96 v43.33,44.96 | v45.77,45.57 46.38,44.96 46.38,44.35 MEGA1281-16AI.19
  Bottom 0.152: v36.78,41.91 v27.18,32.31 | v43.33,44.96 45.16,44.96 v45.77,45.57
N$30  (via drill 0.35)
  Top 0.152: v49.73,35.97 51.56,35.97 54.46,38.86 54.46,39.93 53.7,40.69 53.7,44.2 MEGA1281-16AI.28 | v43.79,18.75 v43.79,26.52
  Bottom 0.152: v49.73,35.97 49.73,32.46 v43.79,26.52 | v43.79,18.75 26.42,1.37 USART.1
N$31  (via drill 0.35)
  Top 0.152: C16_MAX232.- 64.82,29.26 59.79,29.26 C15_MAX232.+ | MAX232.15 35.25,14.78 v36.47,14.78 38.3,14.78 46.38,6.71 53.54,6.71 57.81,2.44 DB9.5
  Bottom 0.152: C14_MAX232.- 74.88,22.86 74.88,25.76 68.63,32 68.63,32.92 C16_MAX232.- | v36.47,14.78 24.28,2.59 16.97,2.59 16.36,3.2 16.36,3.66 9.96,10.06 6.45,10.06 LEFT_CONN.40 | C15_MAX232.+ 59.64,29.11 59.64,7.32 57.96,5.64 57.96,2.44 DB9.5
N$32  (1 unrouted)
  Top 0.152: 26.42,14.17 25.65,14.94 CP2101.7 | 26.42,14.17 26.42,13.72 26.72,13.41 29.62,13.41 30.99,14.78 30.99,23.47 29.31,25.15 C10_CP2101.2 | 26.42,14.17 CP2101.8
N$33  (via drill 0.35)
  Top 0.152: v33.73,7.77 28.7,7.77 23.67,12.8 23.67,15.54 24.13,16 25.5,16 CP2101.5 | v34.65,6.55 36.32,6.55 37.54,5.33 37.54,4.88 USB.2
  Bottom 0.152: v33.73,7.77 33.73,7.47 v34.65,6.55
N$34
  Top 0.152: CP2101.4 25.5,16.46 24.13,16.46 23.37,15.7 23.37,12.65 28.85,7.16 36.47,7.16 38,5.64 38,4.88 USB.3
N$35  (via drill 0.35)
  Top 0.152: v52.63,42.37 52.63,44.2 MEGA1281-16AI.27 | v23.83,11.28 23.83,1.83 24.28,1.37 USART.2
  Bottom 0.152: v52.63,42.37 52.63,40.08 34.65,22.1 34.65,17.83 28.09,11.28 v23.83,11.28
N$37  (via drill 0.35)
  Top 0.152: C9_MICROSD.2 10.41,60.96 6.76,57.3 5.84,57.3 4.93,56.39 4.93,54.71 6.3,53.34 LEFT_CONN.6 | v24.44,15.39 25.5,15.39 CP2101.6 | v22.91,16.92 22.91,25.15 C11_CP2101.2 22.76,25.3 22.61,25.45 v15.9,25.45 | v31.6,30.94 31.6,32.92 C8_MM74HC.1
  Bottom 0.152: v24.44,15.39 v22.91,16.92 31.6,25.6 v31.6,30.94 | v15.9,25.45 11.79,29.57 11.79,41.76 6.76,46.79 6.3,46.79 4.93,48.16 4.93,51.36 6.3,52.73 6.3,53.34 LEFT_CONN.6
N$39  (via drill 0.35)
  Top 0.152: CP2101.25 27.94,23.93 27.48,24.38 27.48,26.06 27.79,26.36 30.68,26.36 32.51,24.54 | 32.51,24.54 33.43,23.62 33.43,17.83 34.34,16.92 35.1,16.92 MAX232.12 | v51.41,46.33 51.41,50.29 45.31,56.39 43.18,56.39 MEGA1281-16AI.3 | 32.51,24.54 v41.5,33.53
  Bottom 0.152: v51.41,46.33 51.41,41 43.94,33.53 v41.5,33.53
N$40
  Top 0.152: MAX232.4 41.05,16.31 41.66,16.31 41.96,16.61 41.96,26.67 C13_MAX232.+
N$41
  Top 0.152: C12_MAX232.+ 46.08,14.33 41.05,14.33 MAX232.1
N$42
  Top 0.152: MAX232.3 41.05,15.54 42.11,15.54 49.43,22.86 C12_MAX232.-
N$43
  Top 0.152: MAX232.5 40.89,16.92 40.44,16.92 36.93,20.42 36.93,26.67 C13_MAX232.-
N$44
  Top 0.152: C14_MAX232.+ 74.57,27.58 57.2,27.58 44.55,14.94 41.05,14.94 MAX232.2
N$45
  Top 0.152: MAX232.6 40.89,17.53 40.44,17.53 40.13,17.83 40.13,27.13 42.11,29.11 54.61,29.11 C15_MAX232.-
N$47  (via drill 0.35)
  Top 0.152: v24.28,13.11 29.77,13.11 30.84,14.17 35.1,14.17 MAX232.16
  Bottom 0.152: 23.22,13.11 11.33,13.11 9.2,15.24 LEFT_CONN.36 | 23.22,13.11 v24.28,13.11 | C16_MAX232.+ 56.29,38.1 28.85,10.67 23.52,10.67 23.22,10.97 23.22,13.11
N$48
  Top 0.152: MAX232.14 35.25,15.39 38.15,15.39 46.53,7.01 55.83,7.01 59.18,3.66 64.97,3.66 66.19,2.44 DB9.2
N$49
  Top 0.152: MAX232.13 35.25,16.15 37.85,16.15 46.68,7.32 61.77,7.32 63.6,5.49 63.6,4.72 64.36,3.96 66.5,3.96 67.56,2.9 67.56,1.98 66.8,1.22 64.67,1.22 63.6,2.29 DB9.3
N$50  (via drill 0.35)
  Top 0.152: v40.89,58.06 43.03,58.06 MEGA1281-16AI.1 | v7.06,62.48 3.86,59.28 3.86,58.52 LEFT_CONN.1
  Bottom 0.152: v40.89,58.06 39.98,58.06 35.56,62.48 v7.06,62.48
N$51  (via drill 0.35)
  Top 0.152: v44.25,55.63 43.18,55.63 MEGA1281-16AI.4
  Bottom 0.152: v44.25,55.63 36.02,63.86 16.36,63.86 4.17,76.05 3.4,76.05 2.79,75.44 2.79,56.84 3.71,55.93 LEFT_CONN.3
N$52  (via drill 0.35)
  Top 0.152: v41.5,54.86 43.03,54.86 MEGA1281-16AI.5 | v36.93,59.44 20.17,59.44 20.02,59.28 18.34,59.28 17.42,60.2 17.42,62.48 17.27,62.64 8.13,62.64 v5.08,59.59
  Bottom 0.152: v36.93,59.44 v41.5,54.86 | v5.08,59.59 5.08,54.56 3.86,53.34 LEFT_CONN.5
N$53  (via drill 0.35)
  Top 0.152: v37.39,54.56 39.22,54.56 39.67,54.1 43.03,54.1 MEGA1281-16AI.6 | v36.17,55.17 34.95,55.17 34.65,54.86 33.27,54.86 29.92,51.51 29.92,51.21 28.4,49.68 14.83,49.68 v8.28,56.24
  Bottom 0.152: v37.39,54.56 36.78,54.56 v36.17,55.17 | v8.28,56.24 6.45,54.41 5.99,54.41 4.93,53.34 4.93,51.97 3.86,50.9 LEFT_CONN.7
N$54  (via drill 0.35)
  Top 0.152: v44.25,53.34 43.18,53.34 MEGA1281-16AI.7 | v6.76,60.35 4.93,58.52 4.93,57.61 4.32,57 3.4,57 2.79,56.39 2.79,49.23 3.71,48.31 LEFT_CONN.9
  Bottom 0.152: v44.25,53.34 35.41,62.18 8.59,62.18 v6.76,60.35
N$55  (via drill 0.35)
  Top 0.152: v33.73,53.95 39.37,53.95 40.74,52.58 43.03,52.58 MEGA1281-16AI.8 | v19.71,45.72 16.66,42.67 v9.8,42.67
  Bottom 0.152: v33.73,53.95 33.73,53.03 26.42,45.72 v19.71,45.72 | v9.8,42.67 7.37,42.67 6.76,42.06 3.4,42.06 2.79,42.67 2.79,44.81 3.71,45.72 LEFT_CONN.11
N$56  (via drill 0.35)
  Top 0.152: v30.84,51.05 33.12,53.34 39.52,53.34 41.05,51.82 43.03,51.82 MEGA1281-16AI.9 | v15.75,47.7 14.07,47.7 9.8,43.43 v9.2,43.43
  Bottom 0.152: v30.84,51.05 19.1,51.05 v15.75,47.7 | v9.2,43.43 7.52,43.43 6.76,44.2 4.78,44.2 3.86,43.28 LEFT_CONN.13
N$57  (via drill 0.35)
  Top 0.152: v33.58,36.58 51.71,36.58 54.15,39.01 54.15,39.78 51.26,42.67 51.26,44.2 MEGA1281-16AI.25 | v26.42,29.41 20.17,29.41 18.19,31.39 15.44,31.39 13.01,28.96 8.59,28.96 7.37,30.18 7.37,35.97 6.3,37.03 5.99,37.03 5.23,37.8 5.23,39.47 6.3,40.54 LEFT_CONN.16
  Bottom 0.152: v26.42,29.41 v33.58,36.58
N$58  (via drill 0.35)
  Top 0.152: v46.23,50.6 51.87,44.96 51.87,44.35 MEGA1281-16AI.26 | v35.41,57.45 31.45,57.45 30.84,58.06 7.98,58.06 6.91,57 5.99,57 5.23,56.24 5.23,55.47 6.3,54.41 6.76,54.41 8.59,52.58 8.59,42.82 11.18,40.23 11.18,36.58 10.41,35.81 8.74,35.81 6.45,38.1 LEFT_CONN.18
  Bottom 0.152: v46.23,50.6 44.86,50.6 38,57.45 v35.41,57.45
N$61  (via drill 0.35)
  Top 0.152: v54.46,43.13 54.46,44.2 MEGA1281-16AI.29 | v8.89,14.63 8.89,24.38 6.45,26.82 5.99,26.82 5.23,27.58 5.23,34.44 LEFT_CONN.20
  Bottom 0.152: v54.46,43.13 65.73,43.13 70.16,38.71 70.16,37.49 63.45,30.79 49.43,30.79 29.01,10.36 13.16,10.36 v8.89,14.63
N$62  (via drill 0.35)
  Top 0.152: v39.67,34.75 50.8,34.75 55.07,39.01 55.07,44.2 MEGA1281-16AI.30 | v34.95,30.02 20.02,30.02 18.34,31.7 15.29,31.7 13.16,29.57 v9.8,29.57
  Bottom 0.152: v34.95,30.02 v39.67,34.75 | LEFT_CONN.22 v9.8,29.57
N$63  (via drill 0.35)
  Top 0.152: v7.98,30.48 7.98,30.94 14.83,37.8 14.99,37.8 21.23,44.04 21.23,45.11 24.59,48.46 27.63,48.46 30.23,51.05 30.23,51.36 33.43,54.56 36.47,54.56 40.59,58.67 43.64,58.67 55.83,46.48 55.83,44.35 MEGA1281-16AI.31
  Bottom 0.152: LEFT_CONN.24 v7.98,30.48
N$64  (via drill 0.35)
  Top 0.152: v19.86,31.09 20.62,30.33 34.34,30.33 38.15,34.14 50.65,34.14 56.59,40.08 56.59,44.2 MEGA1281-16AI.32 | v17.88,29.11 13.61,29.11 12.55,28.04 6.45,28.04 LEFT_CONN.26
  Bottom 0.152: v17.88,29.11 v19.86,31.09
N$65
  Top 0.152: MEGA1281-16AI.41 58.42,52.58 57.96,52.58 57.05,53.49 57.05,58.67 57.51,59.13 76.56,59.13 81.28,54.41 82.65,54.41 83.72,53.34 RIGHT_CONN.6
N$66
  Top 0.152: MEGA1281-16AI.42 58.42,53.34 57.96,53.34 57.35,53.95 57.35,58.52 57.66,58.83 74.27,58.83 80.82,52.27 84.18,52.27 84.94,53.03 84.94,54.71 83.87,55.78 RIGHT_CONN.4
N$67
  Top 0.152: RIGHT_CONN.8 82.8,51.82 80.82,51.82 74.12,58.52 57.81,58.52 57.66,58.37 57.66,54.41 57.96,54.1 58.42,54.1 MEGA1281-16AI.43
N$68
  Top 0.152: MEGA1281-16AI.44 58.57,54.71 60.55,54.71 66.8,48.46 77.62,48.46 77.93,48.16 81.28,48.16 RIGHT_CONN.9
N$69  (via drill 0.35)
  Top 0.152: v78.23,48.77 66.95,48.77 60.25,55.47 58.57,55.47 MEGA1281-16AI.45
  Bottom 0.152: RIGHT_CONN.11 v78.23,48.77
N$70  (via drill 0.35)
  Top 0.152: v72.29,52.27 72.29,53.65 71.83,54.1 66.8,54.1 64.52,56.39 58.57,56.39 MEGA1281-16AI.46
  Bottom 0.152: v72.29,52.27 81.28,43.28 RIGHT_CONN.13
N$71  (via drill 0.35)
  Top 0.152: v63.3,57.15 58.57,57.15 MEGA1281-16AI.47
  Bottom 0.152: v63.3,57.15 64.21,57.15 66.04,55.32 68.17,55.32 80.21,43.28 80.21,41.76 81.28,40.69 RIGHT_CONN.15
N$72  (via drill 0.35)
  Top 0.152: v67.87,54.71 66.65,54.71 63.45,57.91 58.57,57.91 MEGA1281-16AI.48
  Bottom 0.152: v67.87,54.71 68.33,54.71 79.91,43.13 79.91,39.47 RIGHT_CONN.17
N$73  (via drill 0.35)
  Top 0.152: v64.36,59.74 56.74,59.74 MEGA1281-16AI.49
  Bottom 0.152: v64.36,59.74 71.22,52.88 72.59,52.88 78.08,47.4 78.08,46.94 80.82,44.2 81.74,44.2 82.35,43.59 82.35,36.73 81.28,35.66 RIGHT_CONN.19
N$74  (via drill 0.35)
  Top 0.152: v56.44,58.67 55.98,59.13 55.98,59.74 MEGA1281-16AI.50 | v74.12,56.54 v65.73,56.54
  Bottom 0.152: v56.44,58.67 63.6,58.67 v65.73,56.54 | v74.12,56.54 81.28,49.38 81.59,49.38 82.8,48.16 82.8,47.85 83.87,46.79 84.18,46.79 84.94,46.02 84.94,35.2 83.87,34.14 82.35,34.14 81.28,33.07 RIGHT_CONN.21
N$75  (via drill 0.35)
  Top 0.152: v56.13,55.93 55.22,56.84 55.22,59.74 MEGA1281-16AI.51 | v78.69,39.01 78.69,38.41 77.17,36.88 77.17,33.53 80.21,30.48 RIGHT_CONN.23
  Bottom 0.152: v56.13,55.93 58.73,55.93 65.43,49.23 68.48,49.23 v78.69,39.01
N$76  (via drill 0.35)
  Top 0.152: v56.13,54.56 56.13,52.88 54.61,51.36 54,51.36 52.78,52.58 52.78,59.74 MEGA1281-16AI.54
  Bottom 0.152: v56.13,54.56 59.64,54.56 65.28,48.92 67.87,48.92 79.91,36.88 79.91,29.41 81.28,28.04 RIGHT_CONN.25
N$77  (via drill 0.35)
  Top 0.152: v72.44,60.66 52.32,60.66 52.02,60.35 52.02,59.89 MEGA1281-16AI.55
  Bottom 0.152: v72.44,60.66 81.28,51.82 81.74,51.82 82.8,50.75 82.8,50.29 83.72,49.38 84.18,49.38 85.24,48.31 85.24,27.89 83.87,26.52 82.35,26.52 81.28,25.45 RIGHT_CONN.27
N$78  (via drill 0.35)
  Top 0.152: v52.17,58.37 51.26,59.28 51.26,59.74 MEGA1281-16AI.56 | v55.83,57.45 55.83,57.15 56.74,56.24 56.74,45.72 67.87,34.59 70.46,34.59 81.28,23.77 RIGHT_CONN.29
  Bottom 0.152: v52.17,58.37 54.91,58.37 v55.83,57.45
N$79
  Top 0.152: RIGHT_CONN.10 82.8,47.24 80.82,47.24 80.21,47.85 77.78,47.85 77.47,48.16 67.41,48.16 65.43,46.18 58.57,46.18 MEGA1281-16AI.33
N$80  (via drill 0.35)
  Top 0.152: v65.43,48.01 64.52,47.09 58.57,47.09 MEGA1281-16AI.34 | v68.63,47.24 77.78,47.24 78.38,46.63 80.67,46.63 80.82,46.79 82.65,46.79 83.72,45.72 RIGHT_CONN.12
  Bottom 0.152: v65.43,48.01 66.04,48.62 67.26,48.62 v68.63,47.24
N$81  (via drill 0.35)
  Top 0.152: v62.99,47.7 58.57,47.7 MEGA1281-16AI.35 | v66.5,44.2 82.8,44.2 RIGHT_CONN.14
  Bottom 0.152: v66.5,44.2 v62.99,47.7
N$82
  Top 0.152: MEGA1281-16AI.36 58.42,48.46 57.96,48.46 57.66,48.16 57.66,45.72 61.62,41.76 82.65,41.76 83.72,40.69 RIGHT_CONN.16
N$83
  Top 0.152: MEGA1281-16AI.37 58.42,49.23 57.96,49.23 57.35,48.62 57.35,45.57 63.3,39.62 82.19,39.62 83.72,38.1 RIGHT_CONN.18
N$84  (via drill 0.35)
  Top 0.152: v66.34,48.01 64.36,49.99 58.57,49.99 MEGA1281-16AI.38 | v77.78,36.58 82.8,36.58 RIGHT_CONN.20
  Bottom 0.152: v77.78,36.58 v66.34,48.01
N$85  (via drill 0.35)
  Top 0.152: v61.77,50.75 58.57,50.75 MEGA1281-16AI.39 | v78.38,34.14 82.65,34.14 83.72,33.07 RIGHT_CONN.22
  Bottom 0.152: v78.38,34.14 v61.77,50.75
N$86  (via drill 0.35)
  Top 0.152: v59.94,51.66 58.57,51.66 MEGA1281-16AI.40 | v79.3,32.31 80.52,32.31 81.28,31.55 82.65,31.55 83.72,30.48 RIGHT_CONN.24
  Bottom 0.152: v79.3,32.31 v59.94,51.66
N$87  (via drill 0.35)
  Top 0.152: v52.17,57.45 50.49,59.13 50.49,59.74 MEGA1281-16AI.57
  Bottom 0.152: v52.17,57.45 54.91,57.45 55.52,56.84 62.69,56.84 65.43,54.1 68.48,54.1 79.6,42.98 79.6,37.64 80.21,37.03 80.21,32.61 81.28,31.55 81.74,31.55 82.8,30.48 82.8,28.96 RIGHT_CONN.26
N$88  (via drill 0.35)
  Top 0.152: v66.8,61.27 50.49,61.27 49.73,60.5 49.73,59.89 MEGA1281-16AI.58 | v82.8,34.75 83.11,34.75 83.72,34.14 84.18,34.14 84.94,33.38 84.94,26.52 RIGHT_CONN.28
  Bottom 0.152: v66.8,61.27 81.28,46.79 81.74,46.79 82.8,45.72 v82.8,34.75
N$89  (via drill 0.35)
  Top 0.152: v52.17,55.93 48.97,59.13 48.97,59.74 MEGA1281-16AI.59
  Bottom 0.152: v52.17,55.93 53.85,55.93 79.6,30.18 79.6,25.6 81.28,23.93 82.65,23.93 83.72,22.86 RIGHT_CONN.30
N$90  (via drill 0.35)
  Top 0.152: v73.81,61.87 49.58,61.87 48.06,60.35 48.06,59.89 MEGA1281-16AI.60
  Bottom 0.152: v73.81,61.87 81.28,54.41 81.74,54.41 82.8,53.34 82.8,52.88 83.87,51.82 84.33,51.82 85.55,50.6 85.55,22.1 83.87,20.42 RIGHT_CONN.32
N$91  (via drill 0.35)
  Top 0.152: v52.17,54.41 47.3,59.28 47.3,59.74 MEGA1281-16AI.61
  Bottom 0.152: v52.17,54.41 54.91,54.41 79.3,30.02 79.3,23.32 81.28,21.34 81.74,21.34 82.8,20.27 82.8,18.75 83.72,17.83 RIGHT_CONN.34

### Text on the board
Document: PROCESSOR / COMM BOARD